# EAGLE design maplemini (EAGLE 9.2.2)
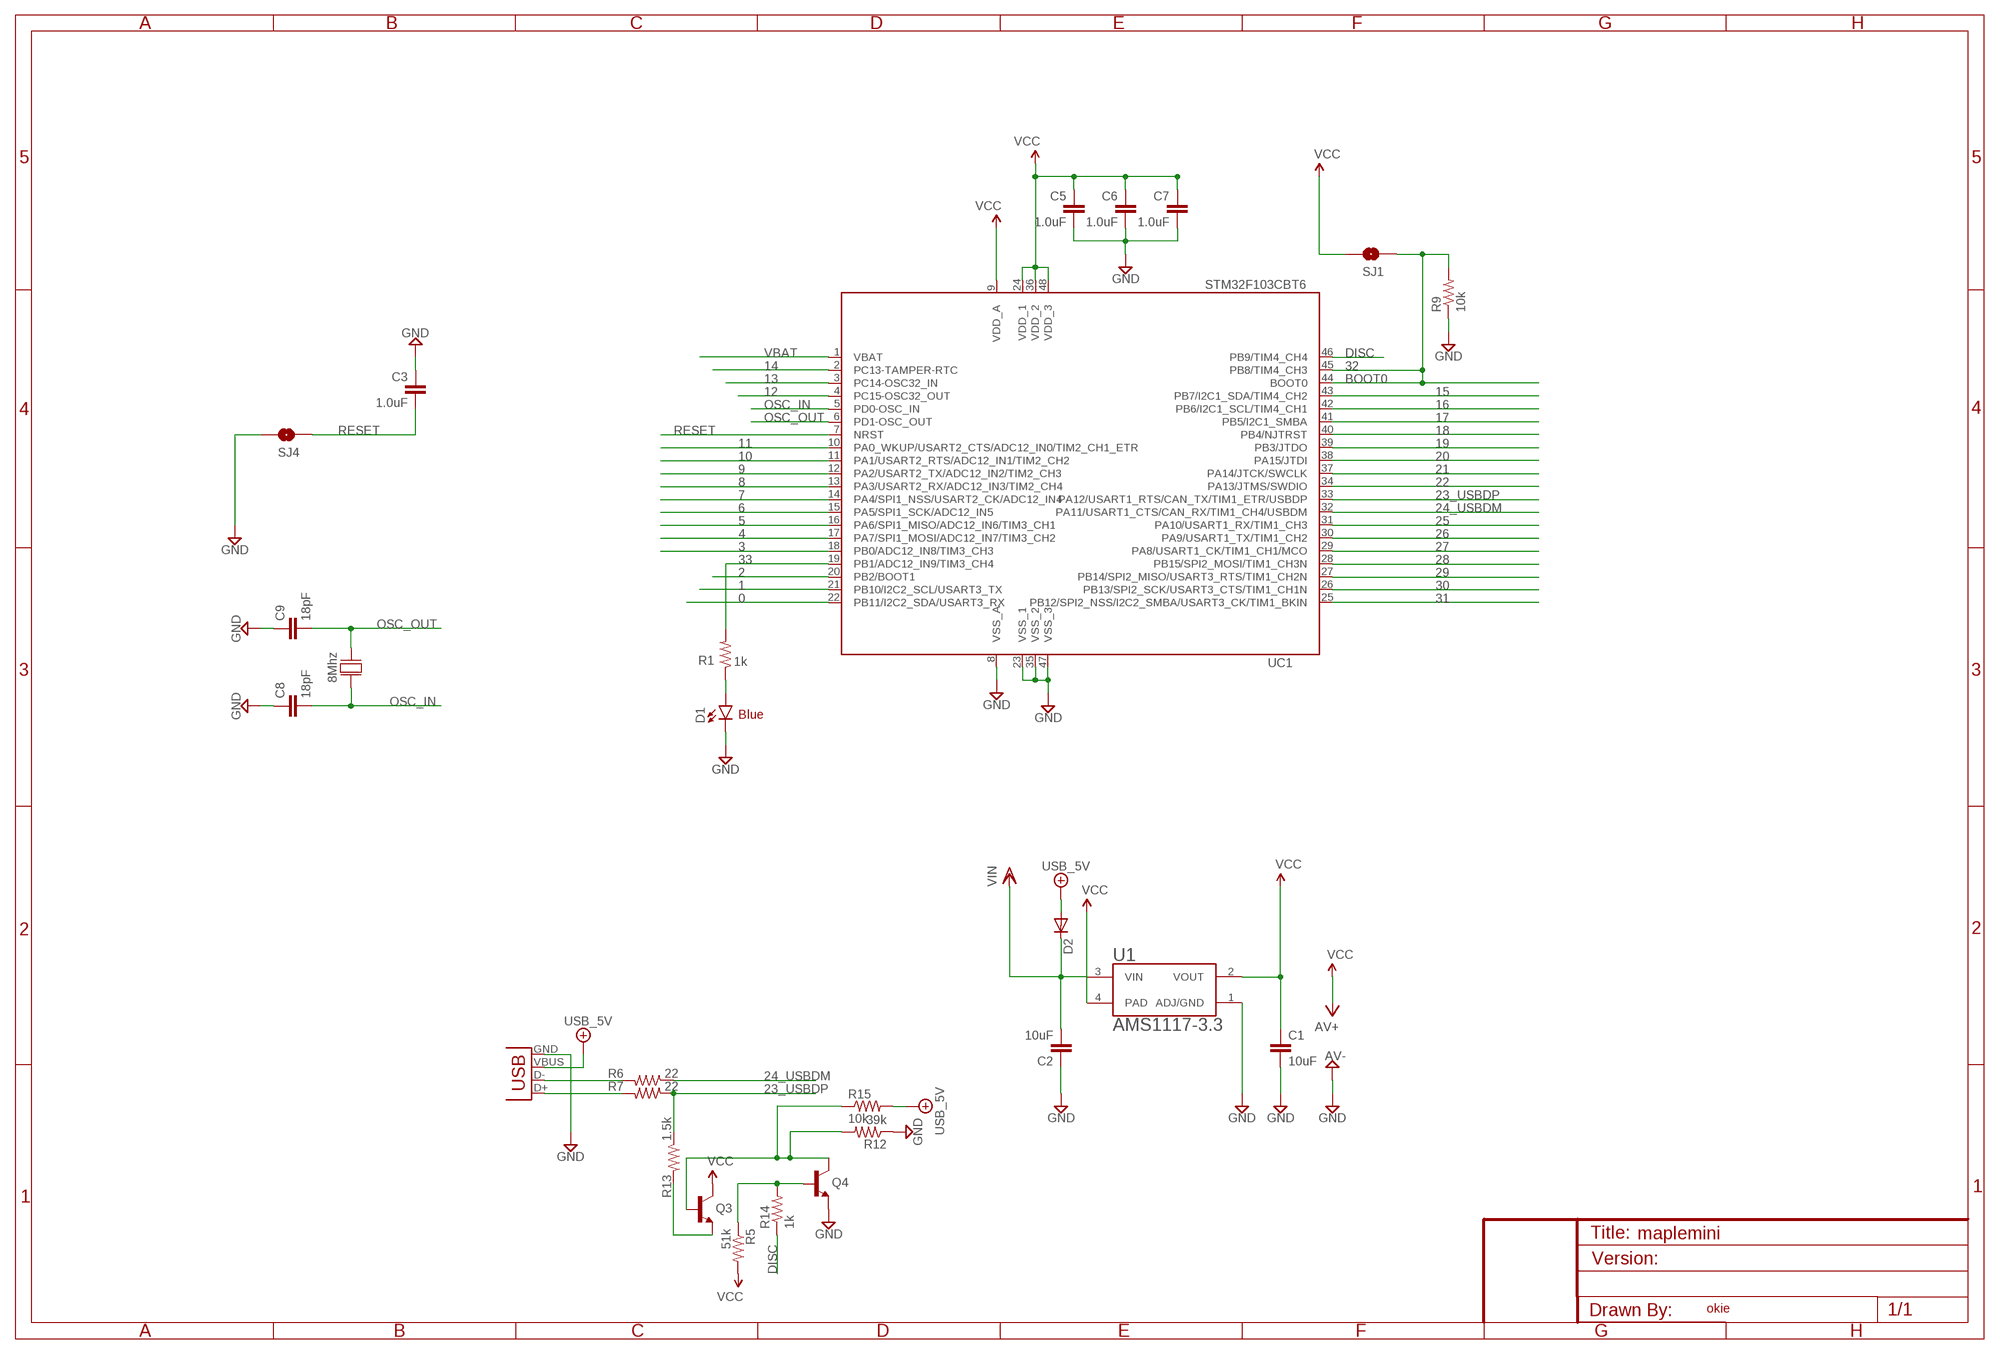
[diagram p0: schematic, sheet 1]

## Parts
C1  10uF  CAP0805  [0805]
C2  10uF  CAP0805  [0805]
C3  1.0uF  1.0UF-0603-16V-10%  [0603]
C5  1.0uF  1.0UF-0603-16V-10%  [0603]
C6  1.0uF  1.0UF-0603-16V-10%  [0603]
C7  1.0uF  1.0UF-0603-16V-10%  [0603]
C8  18pF  18PF-0603-50V-5%  [0603]
C9  18pF  18PF-0603-50V-5%  [0603]
D1  Blue  LED0603  [LED-0603]
D2  DIODESOD  [SOD-323]
Q3  NPN-BJT  TRANSISTOR_NPNSOT23  [SOT23]
Q4  NPN-BJT  TRANSISTOR_NPNSOT23  [SOT23]
R1  1k  1KOHM-0603-1/10W-1%  [0603]
R5  51k  47KOHM-0603-1/10W-1%  [0603]
R6  22  22OHM-0603-1/10W-1%  [0603]
R7  22  22OHM-0603-1/10W-1%  [0603]
R9  10k  10KOHM-0603-1/10W-1%  [0603]
R12  39k  39KOHM-0603-1/10W-1%  [0603]
R13  1.5k  22OHM-0603-1/10W-1%  [0603]
R14  1k  1KOHM-0603-1/10W-1%  [0603]
R15  10k  10KOHM-0603-1/10W-1%  [0603]
SJ1  SOLDERJUMPERNO  [SJ_2S-NO]
SJ4  SOLDERJUMPERNO  [SJ_2S-NO]
U1  AMS1117-3.3  [SOT229P700X180-4N]
U$2  8MHZCRYSTAL  [8MHZCRYSTAL]
UC1  STM32F103CBT6  STM32F103CB  [LQFP48]
X1  USB-MINIB  USBSMD  [USB-MINIB]

## Nets
0: UC1.22(PB11/I2C2_SDA/USART3_RX)
1: UC1.21(PB10/I2C2_SCL/USART3_TX)
2: UC1.20(PB2/BOOT1)
3: UC1.18(PB0/ADC12_IN8/TIM3_CH3)
4: UC1.17(PA7/SPI1_MOSI/ADC12_IN7/TIM3_CH2)
5: UC1.16(PA6/SPI1_MISO/ADC12_IN6/TIM3_CH1)
6: UC1.15(PA5/SPI1_SCK/ADC12_IN5)
7: UC1.14(PA4/SPI1_NSS/USART2_CK/ADC12_IN4)
8: UC1.13(PA3/USART2_RX/ADC12_IN3/TIM2_CH4)
9: UC1.12(PA2/USART2_TX/ADC12_IN2/TIM2_CH3)
10: UC1.11(PA1/USART2_RTS/ADC12_IN1/TIM2_CH2)
11: UC1.10(PA0_WKUP/USART2_CTS/ADC12_IN0/TIM2_CH1_ETR)
12: UC1.4(PC15-OSC32_OUT)
13: UC1.3(PC14-OSC32_IN)
14: UC1.2(PC13-TAMPER-RTC)
15: UC1.43(PB7/I2C1_SDA/TIM4_CH2)
16: UC1.42(PB6/I2C1_SCL/TIM4_CH1)
17: UC1.41(PB5/I2C1_SMBA)
18: UC1.40(PB4/NJTRST)
19: UC1.39(PB3/JTDO)
20: UC1.38(PA15/JTDI)
21: UC1.37(PA14/JTCK/SWCLK)
22: UC1.34(PA13/JTMS/SWDIO)
23_USBDP: R7.1 R13.1 UC1.33(PA12/USART1_RTS/CAN_TX/TIM1_ETR/USBDP)
24_USBDM: R6.1 UC1.32(PA11/USART1_CTS/CAN_RX/TIM1_CH4/USBDM)
25: UC1.31(PA10/USART1_RX/TIM1_CH3)
26: UC1.30(PA9/USART1_TX/TIM1_CH2)
27: UC1.29(PA8/USART1_CK/TIM1_CH1/MCO)
28: UC1.28(PB15/SPI2_MOSI/TIM1_CH3N)
29: UC1.27(PB14/SPI2_MISO/USART3_RTS/TIM1_CH2N)
30: UC1.26(PB13/SPI2_SCK/USART3_CTS/TIM1_CH1N)
31: UC1.25(PB12/SPI2_NSS/I2C2_SMBA/USART3_CK/TIM1_BKIN)
32: R9.2 SJ1.1 UC1.44(BOOT0) UC1.45(PB8/TIM4_CH3)
33: R1.2 UC1.19(PB1/ADC12_IN9/TIM3_CH4)
+5V/2: D2.2(A) R15.2 X1.VBUS ; supply symbol labelled USB_5V
DGND: C1.2 C2.1 C3.1 C5.2 C6.2 C7.2 C8.1 C9.1 D1.C Q4.2(E) R9.1 R12.1 SJ4.2 U1.1(ADJ/GND) UC1.8(VSS_A) UC1.23(VSS_1) UC1.35(VSS_2) UC1.47(VSS_3) X1.GND ; supply symbol labelled GND, AV-
DISC: R14.1 UC1.46(PB9/TIM4_CH4)
N$2: D1.A R1.1
N$3: Q3.2(E) R13.2
N$6: Q4.1(B) R5.1 R14.2
N$7: Q3.1(B) Q4.3(C) R12.2 R15.1
N$59: R6.2 X1.D-
N$60: R7.2 X1.D+
OSC_IN: C8.2 U$2.P$1 UC1.5(PD0-OSC_IN)
OSC_OUT: C9.2 U$2.P$2 UC1.6(PD1-OSC_OUT)
RESET: C3.2 SJ4.1 UC1.7(NRST)
VBAT: UC1.1(VBAT)
VCC: C1.1 C5.1 C6.1 C7.1 Q3.3(C) R5.2 SJ1.2 U1.2(VOUT) U1.4(PAD) UC1.9(VDD_A) UC1.24(VDD_1) UC1.36(VDD_2) UC1.48(VDD_3) ; supply symbol labelled AV+
VIN: C2.2 D2.1(C) U1.3(VIN)

## Notes on the sheet
- BOOT0
- Blue
- okie

## Library data of the parts
C1 C2 = SparkFun2:CAP: Capacitor Standard 0603 ceramic capacitor, and 0.1" leaded capacitor.
C3 C5-C7 = SparkFun-Capacitors:1.0UF: 1µF ceramic capacitors A capacitor is a passive two-terminal electrical component used to store electrical energy temporarily in an electric field.; PROD_ID: CAP-00868
C8 C9 = SparkFun-Capacitors:18PF: 18pF ceramic capacitors A capacitor is a passive two-terminal electrical component used to store electrical energy temporarily in an electric field.; PROD_ID: CAP-08267
D1 = SparkFun-LED:LED: LED (Generic) Standard schematic elements and footprints for 5mm, 3mm, 1206, and 0603 sized LEDs. Generic LEDs with no color specified.
D2 = SparkFun3:DIODE: Diode These are standard reverse protection diodes and small signal diodes. SMA package can handle up to about 1A. SOD-323 can handle about 200mA. What the SOD-323 package when ordering, there are some mfgs out there that are 5-pin packages.
Q3 Q4 = SparkFun2:TRANSISTOR_NPN: Transistor NPN BJT configuration in SOT23 package. MMBT2222 is the common NPN we use. Double check BCE configuration again layout.
R1 R14 = SparkFun-Resistors:1KOHM: 1kΩ resistor A resistor is a passive two-terminal electrical component that implements electrical resistance as a circuit element. Resistors act to reduce current flow, and, at the same time, act to lower voltage levels within circuits. - Wikipedia; PROD_ID: RES-07856
R5 = SparkFun-Resistors:47KOHM: 47kΩ resistor A resistor is a passive two-terminal electrical component that implements electrical resistance as a circuit element. Resistors act to reduce current flow, and, at the same time, act to lower voltage levels within circuits. - Wikipedia; PROD_ID: RES-07871; VALUE: 47k
R6 R7 = SparkFun-Resistors:22OHM: 22Ω resistor A resistor is a passive two-terminal electrical component that implements electrical resistance as a circuit element. Resistors act to reduce current flow, and, at the same time, act to lower voltage levels within circuits. - Wikipedia; PROD_ID: RES-08698
R9 R15 = SparkFun-Resistors:10KOHM: 10kΩ resistor A resistor is a passive two-terminal electrical component that implements electrical resistance as a circuit element. Resistors act to reduce current flow, and, at the same time, act to lower voltage levels within circuits. - Wikipedia; PROD_ID: RES-00824
R12 = SparkFun-Resistors:39KOHM: 39kΩ resistor A resistor is a passive two-terminal electrical component that implements electrical resistance as a circuit element. Resistors act to reduce current flow, and, at the same time, act to lower voltage levels within circuits. - Wikipedia; PROD_ID: RES-12377
R13 = SparkFun-Resistors:22OHM: 22Ω resistor A resistor is a passive two-terminal electrical component that implements electrical resistance as a circuit element. Resistors act to reduce current flow, and, at the same time, act to lower voltage levels within circuits. - Wikipedia; PROD_ID: RES-08698; VALUE: 22
SJ1 SJ4 = SparkFun:SOLDERJUMPER: Solder Jumper Standard SMD solder jumper. Used to automate production. Two varients : Normally Open and Normally Closed are the same, but have different paste layers. NC will have a large amount of paste and should jumper during reflow.
U1 = AMS1117-3.3:AMS1117-3.3: Sot223/Pkg 1-Amp 3.3-Volt Low Drop Out Voltage Regulatator; AVAILABILITY: Unavailable; DESCRIPTION: Sot223/Pkg 1-Amp 3.3-Volt Low Drop Out Voltage Regulatator; MF: Advanced Monolithic Systems; MP: AMS1117-3.3; PACKAGE: None; PRICE: None
U$2 = Maple Mini Clone:8MHZCRYSTAL
UC1 = stm32:STM32F103CB
X1 = SparkFun2:USB: USB Connectors USB-B-PTH is fully proven SKU : PRT-00139 USB-miniB is fully proven SKU : PRT-00587 USB-A-PCB is untested. USB-A-H is throughly reviewed, but untested. Spark Fun Electronics SKU : PRT-00437 USB-B-SMT is throughly reviewed, but untested. Needs silkscreen touching up. USB-A-S has not been used/tested USB-MB-H has not been used/tested

## Net classes
0 Default: width 0.203 mm
1 vcc: width 0.254 mm

## Board
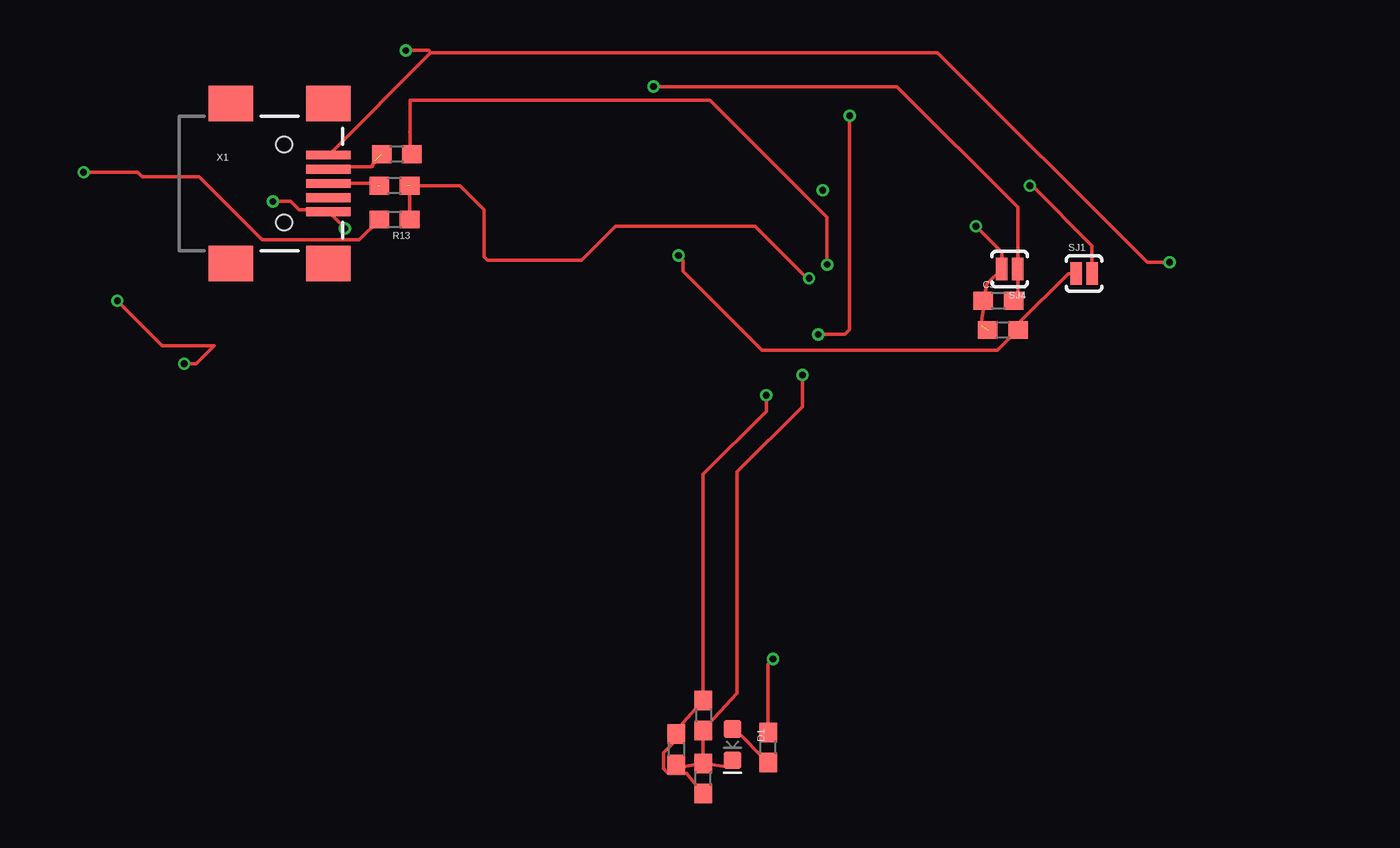
[diagram p1: board, top side]
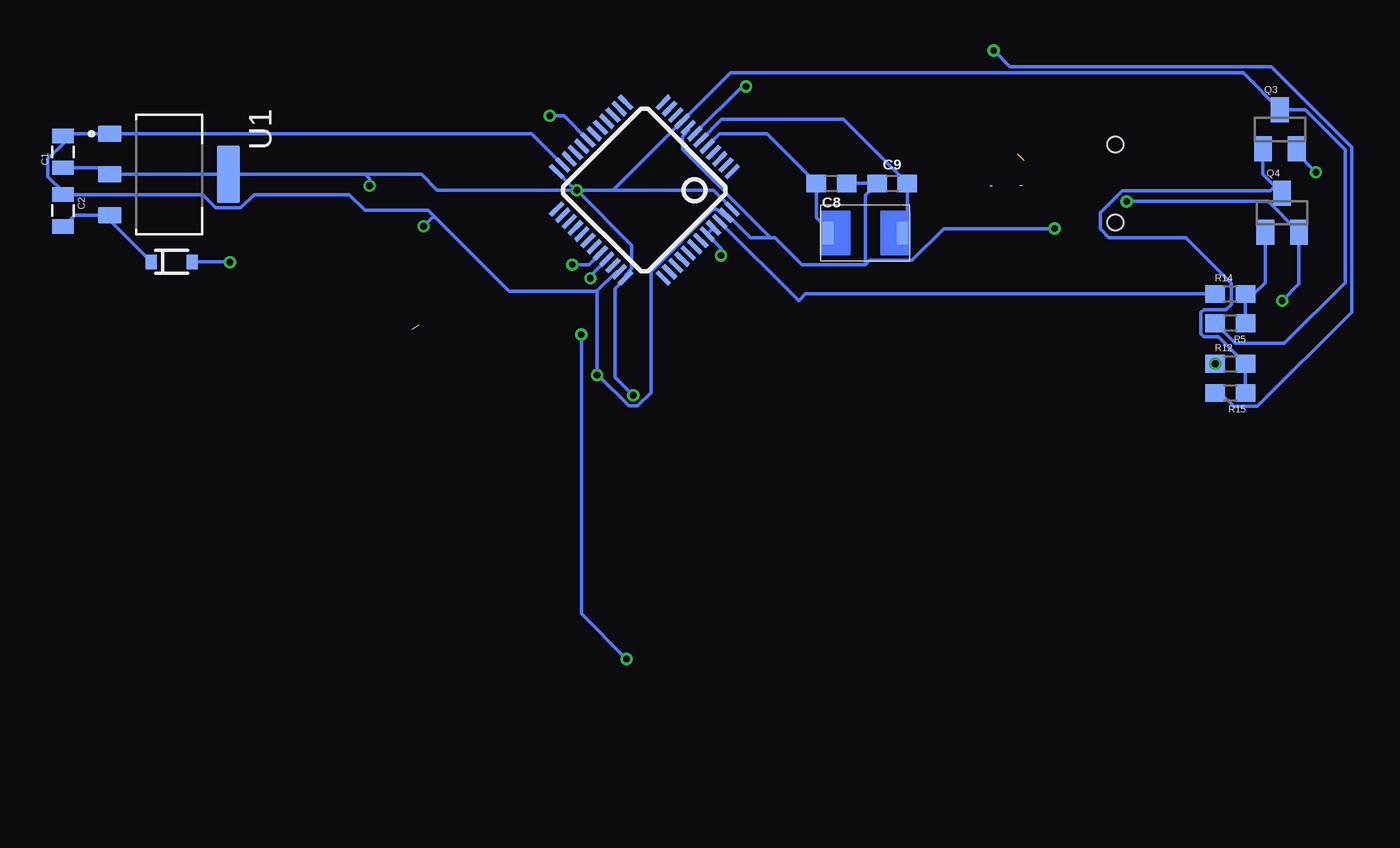
[diagram p2: board, bottom side, seen from below]

No outline drawn. Coordinates in mm, seen from the top.
Copper layers (1*16): Top 0.035mm / dielectric 1.5mm / Bottom 0.035mm
Design rules "default *": minimum track width 6mil, minimum drill 15mil, track to track 6mil, track to pad 6mil, pad to pad 6mil, via to via 6mil, smd to smd 6mil, copper to edge 12mil, drill to drill 15mil, minimum pad ring 6mil, minimum via ring 6mil, stop-mask expansion 0mil, vias tented up to drill 15mil, thermal gap 8mil

### Footprints (pad centres in the part's own frame; a part is rotated, then mirrored left to right if it is on the bottom)
0805 = smd 0.8 x 1.2: 1 -0.9,0; 2 0.9,0
0603 = smd 1.1 x 1: 1 -0.85,0; 2 0.85,0
LED-0603 = smd 1 x 1: A -0.877,0; C 0.877,0
SOD-323 = smd 0.63 x 0.83: 1 -1.15,0; 2 1.15,0
SOT23 = smd 1 x 1.4: 1 -0.95,-1.1; 2 0.95,-1.1; 3 0,1.1
SJ_2S-NO = smd 0.635 x 1.27: 1 -0.45,0; 2 0.45,0
SOT229P700X180-4N = smd 0.93 x 1.31: 1 -2.29,-3.345; 2 0,-3.345; 3 2.29,-3.345 | smd 3.24 x 1.31: 4 0,3.345
8MHZCRYSTAL = smd 0.635 x 1.27: P$1 -2.1,0; P$2 2.1,0
LQFP48 = smd 0.254 x 1: 1 -2.75,-4.25; 2 -2.25,-4.25; 3 -1.75,-4.25; 4 -1.25,-4.25; 5 -0.75,-4.25; 6 -0.25,-4.25; 7 0.25,-4.25; 8 0.75,-4.25; 9 1.25,-4.25; 10 1.75,-4.25; 11 2.25,-4.25; 12 2.75,-4.25; 25 2.75,4.25; 26 2.25,4.25; 27 1.75,4.25; 28 1.25,4.25; 29 0.75,4.25; 30 0.25,4.25; 31 -0.25,4.25; 32 -0.75,4.25; 33 -1.25,4.25; 34 -1.75,4.25; 35 -2.25,4.25; 36 -2.75,4.25 | smd 1 x 0.254: 13 4.25,-2.75; 14 4.25,-2.25; 15 4.25,-1.75; 16 4.25,-1.25; 17 4.25,-0.75; 18 4.25,-0.25; 19 4.25,0.25; 20 4.25,0.75; 21 4.25,1.25; 22 4.25,1.75; 23 4.25,2.25; 24 4.25,2.75; 37 -4.25,2.75; 38 -4.25,2.25; 39 -4.25,1.75; 40 -4.25,1.25; 41 -4.25,0.75; 42 -4.25,0.25; 43 -4.25,-0.25; 44 -4.25,-0.75; 45 -4.25,-1.25; 46 -4.25,-1.75; 47 -4.25,-2.25; 48 -4.25,-2.75
USB-MINIB = smd 2.5 x 0.5: D+ 2.5,0; D- 2.5,0.8; GND 2.5,-1.6; ID 2.5,-0.8; VBUS 2.5,1.6 | smd 2.5 x 2: GND@1 -3,-4.5; GND@2 -3,4.5; GND@3 2.5,4.5; GND@4 2.5,-4.5 | hole 0.9: 0,2.2; 0,-2.2

### Placement (x,y rotation side)
C1  59.31,13.21 90 bottom
C2  59.31,9.91 270 bottom
C3  40.26,4.83 0 top
C5  23.62,-18.54 270 top
C6  22.1,-20.45 270 top
C7  23.62,-22.1 90 top
C8  16,11.43 180 bottom
C9  12.57,11.43 0 bottom
D1  25.27,-20.19 270 top
D2  53.19,7.01 0 bottom
Q3  -9.27,14.48 0 bottom
Q4  -9.4,9.78 0 bottom
R1  27.28,-20.35 90 top
R5  -6.48,3.56 180 bottom
R6  6.35,13.08 180 top
R7  6.22,11.3 180 top
R9  40.51,3.17 0 top
R12  -6.48,1.27 0 bottom
R13  6.22,9.4 180 top
R14  -6.48,5.21 0 bottom
R15  -6.48,-0.38 180 bottom
SJ1  45.09,6.35 0 top
SJ4  40.89,6.6 180 top
U1  53.34,11.94 270 bottom
U$2  14.1,8.64 0 bottom
UC1  26.54,11.05 135 bottom
X1  0,11.43 0 top

### Tracks (layer width: path | path; a pad name or v marks a point on that pad's centre or on a via)
23_USBDP  (via drill 0.38)  (1 unrouted)
  Top 0.203: 6.95,11.3 9.91,11.3 11.27,9.94 11.27,7.3 11.46,7.11 16.76,7.11 18.67,9.02 26.54,9.02 29.46,6.1 v29.59,6.1 | R7.1 R13.1
  Bottom 0.203: v29.59,6.1 29.59,6.23 UC1.33
24_USBDM  (via drill 0.38)
  Top 0.203: 7.07,14.35 7.11,14.35 | v30.61,6.86 30.61,9.53 24,16.13 7.11,16.13 7.11,14.35 | R6.1 7.11,13.17 7.11,14.35
  Bottom 0.203: v30.61,6.86 29.67,6.86 UC1.32
32  (via drill 0.38)
  Top 0.203: SJ1.1 44.2,6.35 41.36,3.52 R9.2 40.21,2.02 26.94,2.02 22.48,6.48 22.48,7.11 v22.23,7.37
  Bottom 0.203: v22.23,7.37 22.23,7.79 UC1.44 UC1.45
33  (via drill 0.38)
  Top 0.203: v31.88,15.24 31.88,3.17 31.62,2.92 v30.1,2.92 | v27.56,-15.37 27.28,-15.65 R1.2
  Bottom 0.203: UC1.19 31.09,15.24 v31.88,15.24 | v30.1,2.92 30.1,-12.83 v27.56,-15.37
+5V/2  (via drill 0.38)
  Top 0.203: X1.VBUS 8.27,18.8 | v49.91,6.99 48.64,6.99 36.83,18.8 8.27,18.8 | v6.86,18.92 8.14,18.92 8.27,18.8
  Bottom 0.203: v49.91,6.99 49.94,7.01 D2.2 | R15.2 -5.92,-0.38 -6.67,-1.14 -8.01,-1.14 -13.31,4.17 -13.31,13.48 -8.78,18.01 5.94,18.01 v6.86,18.92
DGND  (via drill 0.38)  (1 unrouted)
  Top 0.203: v-0.64,10.41 0.38,10.41 0.84,9.96 2.37,9.96 X1.GND v3.43,8.9 v3.43,8.89 | v-9.4,4.83 -6.86,2.29 -3.94,2.29 -4.95,1.27 R12.1 | v38.99,9.02 40.44,7.56 SJ4.2 39.61,5.77 C3.1 39.48,4.7 39.28,3.43 | D1.C 24.89,-21.45 C7.2 | C7.2 C5.2 25.53,-17.29 25.53,-4.83 29.21,-1.14 v29.21,0.64 | C7.2 22.45,-21.45 C6.2
  Bottom 0.203: UC1.23 32.9,14.23 U1.1 59.19,14.23 C1.2 59.31,13.67 60.16,12.81 60.16,11.8 59.31,10.95 C2.1 51.44,10.81 50.7,10.06 49.29,10.06 48.55,10.81 43.19,10.81 42.29,9.91 38.73,9.91 38.35,9.53 | UC1.35 28.13,6.45 29.23,5.35 | 29.23,5.35 34.18,5.35 38.35,9.53 | v-0.64,10.41 -8.61,10.41 Q4.2 -10.35,5.78 v-9.4,4.83 | C8.1 C9.1 14.1,10.76 14.1,6.86 | 14.1,6.86 17.65,6.86 19.18,8.38 19.43,8.38 | 19.43,8.38 20.57,8.38 21.83,9.63 UC1.47 22.11,9.63 22.46,9.98 22.67,9.98 26.18,6.47 26.18,-0.35 26.93,-1.1 27.43,-1.1 29.16,0.64 v29.21,0.64 29.21,5.33 29.23,5.35 | v3.43,8.89 9.68,8.89 11.46,7.11 13.85,7.11 14.1,6.86 | v38.99,9.02 38.48,9.53 38.35,9.53 | UC1.8 24.07,14.42 24.41,14.07 24.41,13.36 19.43,8.38
  other vias: -5.63,1.27
DISC
  Bottom 0.203: UC1.46 17.84,4.83 17.46,5.21 R14.1
N$2
  Top 0.203: R1.1 25.4,-19.32 D1.A
N$3  (via drill 0.38)
  Top 0.203: v-11.3,12.06 -8.26,12.06 -8,11.81 -4.79,11.81 -1.23,8.26 4.23,8.26 R13.2
  Bottom 0.203: Q3.2 -10.11,13.26 v-11.3,12.06
N$6
  Bottom 0.203: Q4.1 -8.45,5.84 -7.81,5.21 R14.2 R5.1
N$7
  Bottom 0.203: Q3.1 -8.32,11.96 -8.99,11.28 | -8.99,11.28 Q4.3 | R15.1 R12.2 -5.79,2.8 -4.97,2.8 -4.82,2.95 -4.82,4.16 -4.97,4.31 -6.23,4.31 -6.52,4.6 -6.52,5.81 -3.96,8.37 0.35,8.37 0.86,8.88 0.86,9.77 -0.39,11.01 -8.72,11.01 -8.99,11.28
N$59  (1 unrouted)
  Top 0.203: X1.D- 2.63,12.36 4.92,12.36 5.12,12.7
N$60  (1 unrouted)
  Top 0.203: X1.D+ 5.32,11.43 5.25,11.3
OSC_IN
  Bottom 0.203: 16,8.64 16.85,9.49 C8.2 19.65,14.22 22.31,14.22 UC1.5 | 15.75,8.38 16,8.64 | 16,8.64 U$2.P$1
OSC_OUT
  Bottom 0.203: UC1.6 22.2,15.04 15.33,15.04 C9.2 11.72,8.91 U$2.P$2
RESET  (via drill 0.38)
  Top 0.203: v20.83,16.89 34.54,16.89 41.34,10.09 SJ4.1 41.34,5.26 C3.2
  Bottom 0.203: UC1.7 21.05,16.89 v20.83,16.89
VCC  (via drill 0.38)
  Top 0.203: SJ1.2 45.53,7.93 42.16,11.3 v42.04,11.3 | C7.1 22.68,-21.8 21.64,-21.8 21.39,-21.55 21.39,-20.64 22.1,-19.94 C6.1 22.1,-19.42 C5.1 23.62,-4.95 27.18,-1.4 v27.18,-0.51
  Bottom 0.203: C1.1 57.05,12.31 U1.2 U1.4 42.29,11.94 | 42.29,11.94 39.12,11.94 38.23,11.05 v30.35,11.05 | v30.35,11.05 30.43,11.05 UC1.24 | v30.35,11.05 27.26,7.96 27.26,6.61 27.6,6.27 UC1.36 28.19,5.51 28.19,0.51 v27.18,-0.51 | v30.35,11.05 28.31,11.05 UC1.9 21.71,17.65 -7.2,17.65 Q3.3 -10.71,15.58 -12.95,13.34 -12.95,5.84 -9.53,2.41 -6.77,2.41 R5.2 | UC1.48 22.65,11.05 v30.35,11.05 | v42.04,11.3 42.04,11.68 42.29,11.94
VIN
  Bottom 0.203: C2.2 58.67,9.65 U1.3 56.69,9.36 D2.1